# Altium schematic sheet [02] - BLOCK DIAGRAM.SchDoc
size A2; DocumentNumber: 2; SheetNumber: 2; SheetTotal: 31; PageSetup: Record=PageOptions|CenterHorizontal=True|CenterVertical=True|PrintScale=0.52|XCorrection=1.00|YCorrection=1.00|PrintKind=1|BorderSize=5000000|LeftOffset=0|BottomOffset=0|Orientation=2|PaperLength=1000|PaperWidth=1000|Scale=100|PaperSource=4|PrintQuality=600|MediaType=1|DitherType=10|PrintScaleMode=1|PaperKind=A4|PaperIndex=9
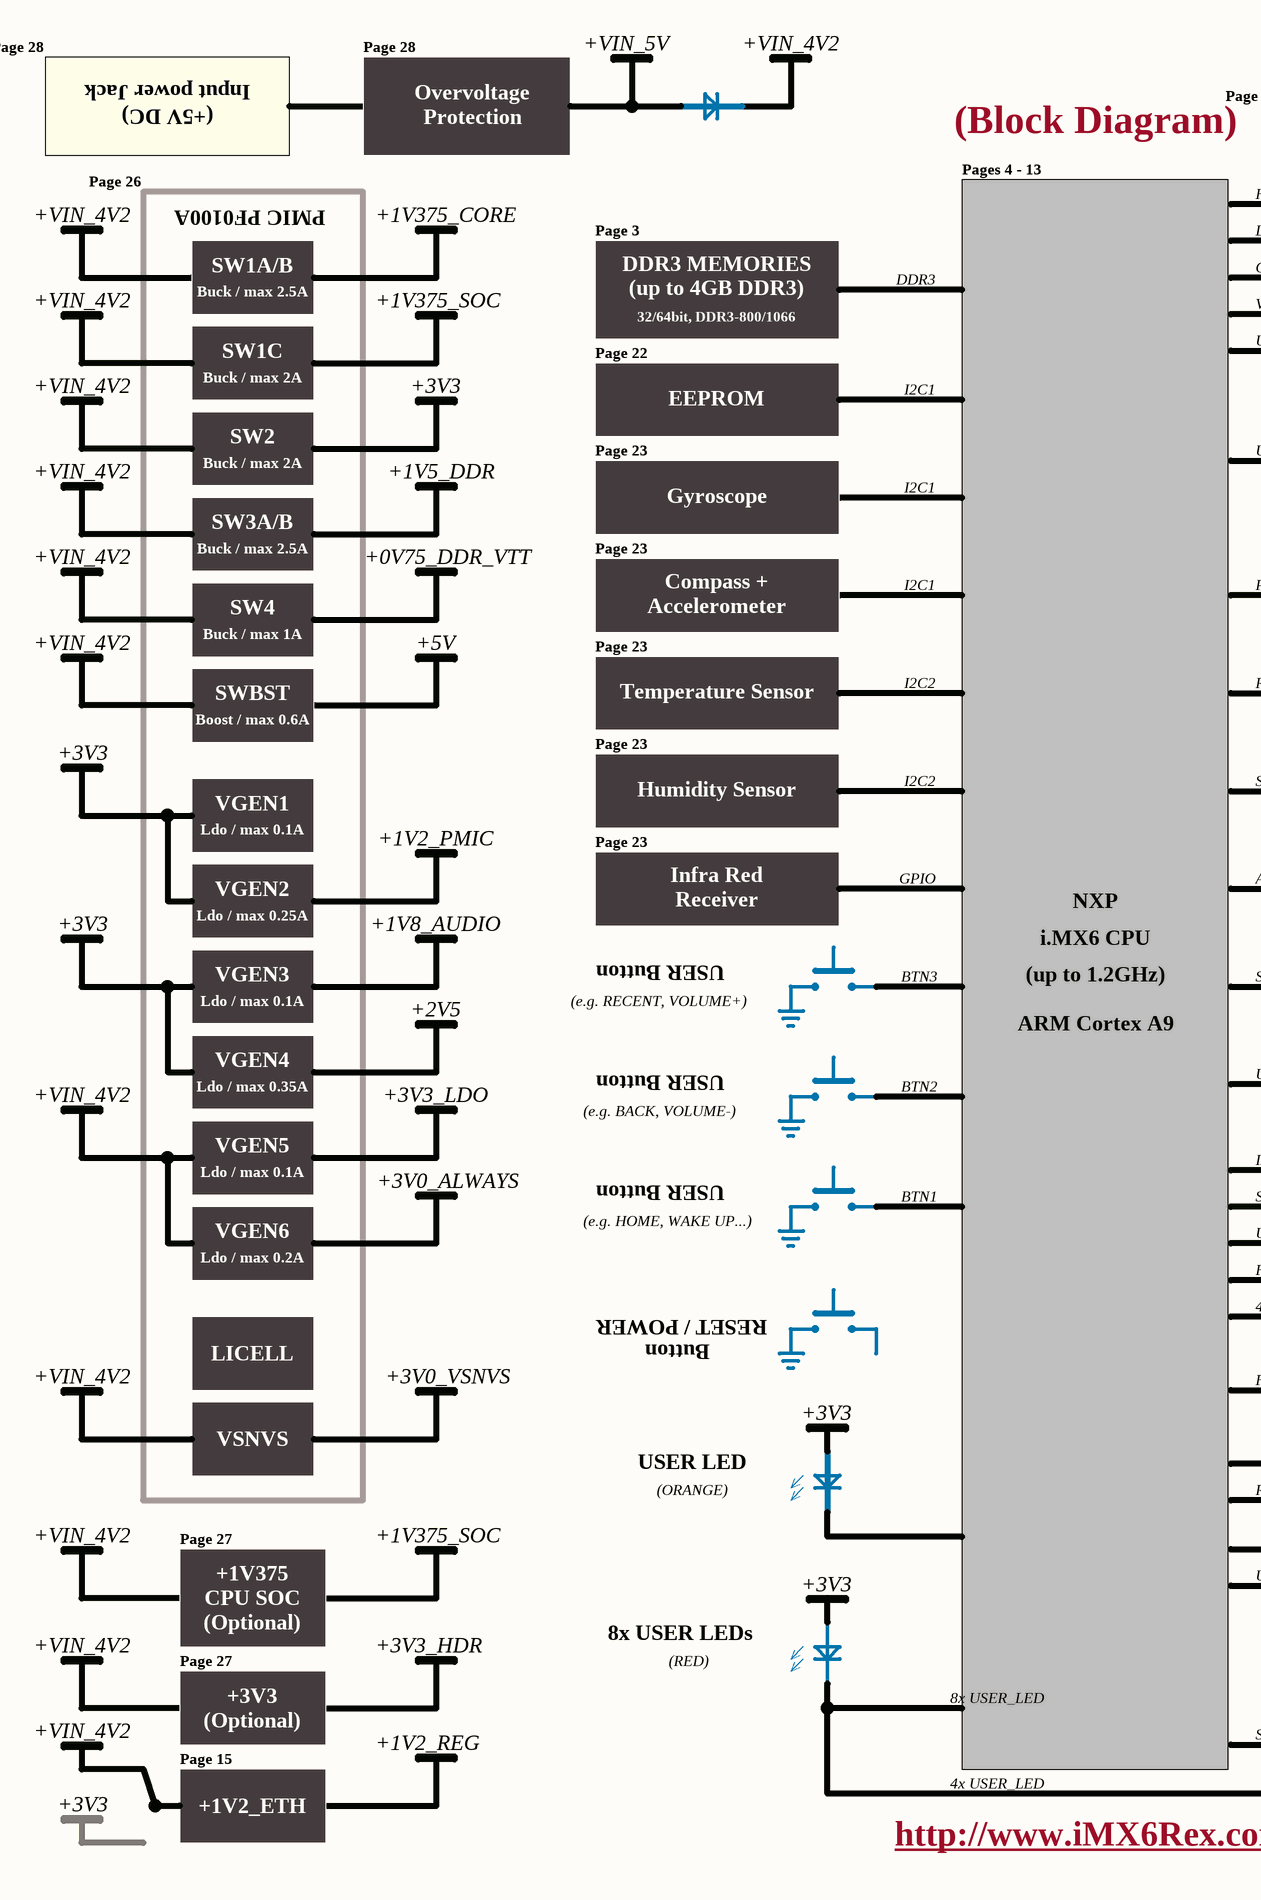
[diagram p0: [02] - BLOCK DIAGRAM.SchDoc, left]
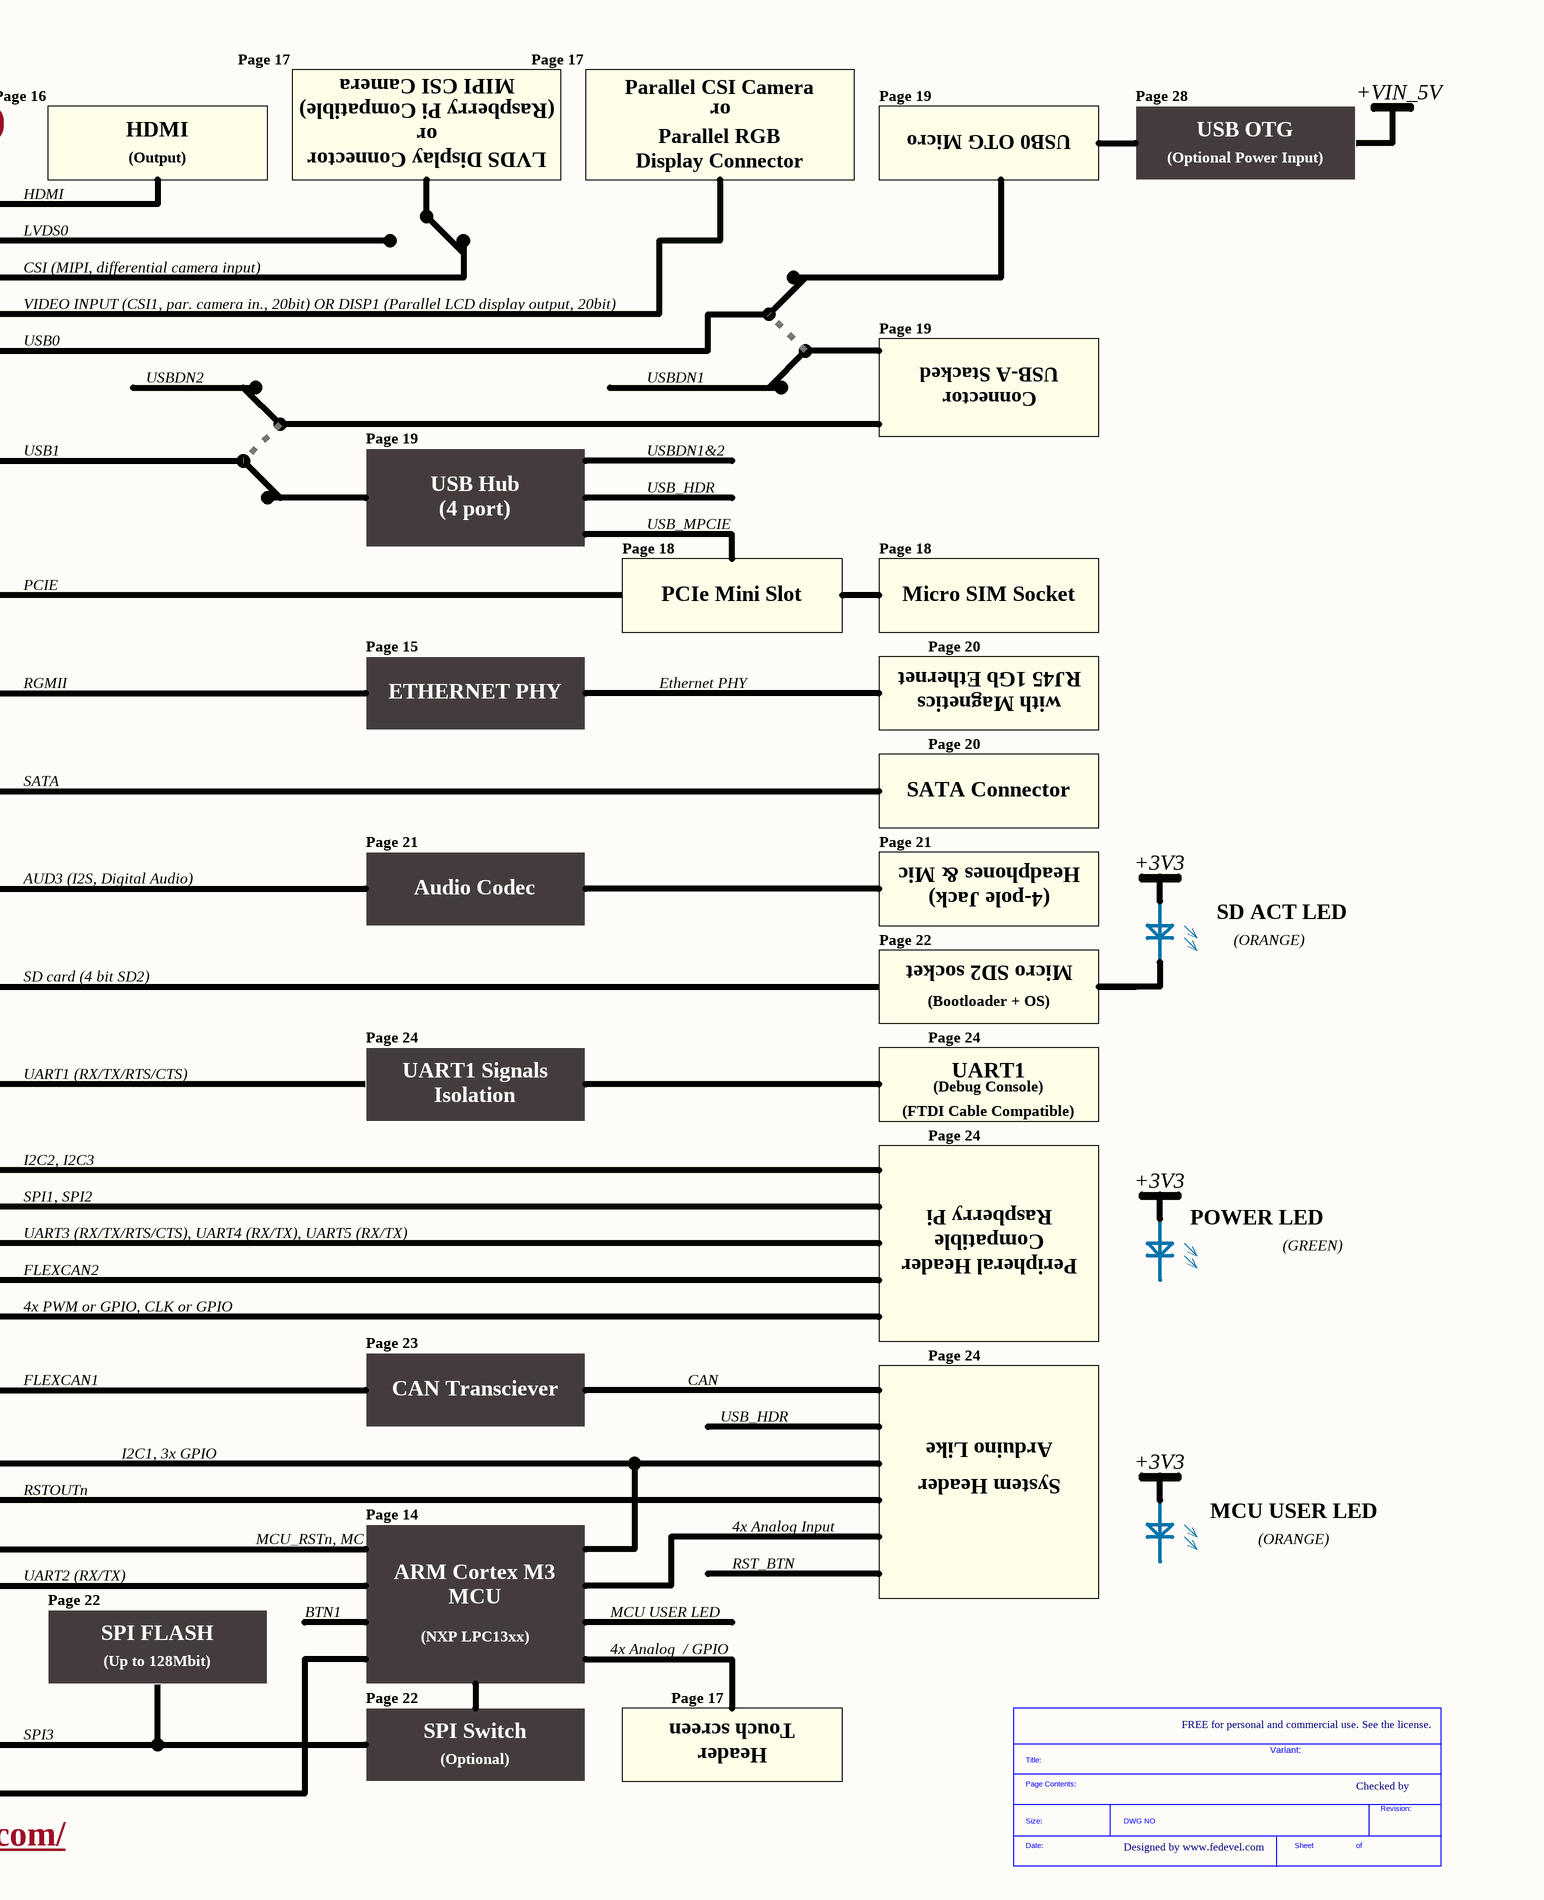
[diagram p1: [02] - BLOCK DIAGRAM.SchDoc, right]

## Parts
*  SDTitleBlock  (value not drawn)  (graphical)

## Notes on the sheet
- Page 28
- +VIN_5V
- +VIN_4V2
- Page 17
- MIPI CSI Camera
- Parallel CSI Camera
- Input power Jack
- (+5V DC)
- Overvoltage
- Protection
- (Block Diagram)
- Page 16
- HDMI
- (Raspberry Pi Compatible)
- or
- Parallel RGB
- Page 19
- USB0 OTG Micro
- USB OTG
- Page 26
- PMIC PF0100A
- Pages 4 - 13
- (Output)
- LVDS Display Connector
- Display Connector
- (Optional Power Input)
- SW1A/B
- +1V375_CORE
- Page 3
- DDR3 MEMORIES
- LVDS0
- CSI (MIPI, differential camera input)
- Buck / max 2.5A
- +1V375_SOC
- 32/64bit, DDR3-800/1066
- (up to 4GB DDR3)
- DDR3
- VIDEO INPUT (CSI1, par. camera in., 20bit) OR DISP1 (Parallel LCD display output, 20bit)
- SW1C
- Buck / max 2A
- +3V3
- Page 22
- I2C1
- USB0
- USBDN2
- USBDN1
- USB-A Stacked
- SW2
- Page 23
- EEPROM
- USB1
- USBDN1&2
- Connector
- SW3A/B
- +1V5_DDR
- Gyroscope
- USB Hub
- (4 port)
- USB_HDR
- +0V75_DDR_VTT
- Page 18
- USB_MPCIE
- SW4
- Buck / max 1A
- Compass +
- Accelerometer
- PCIE
- PCIe Mini Slot
- Micro SIM Socket
- SWBST
- +5V
- Temperature Sensor
- I2C2
- RGMII
- Page 15
- ETHERNET PHY
- Ethernet PHY
- Page 20
- RJ45 1Gb Ethernet
- Boost / max 0.6A
- with Magnetics
- VGEN1
- Humidity Sensor
- SATA
- SATA Connector
- Ldo / max 0.1A
- VGEN2
- +1V2_PMIC
- Infra Red
- GPIO
- AUD3 (I2S, Digital Audio)
- Page 21
- Headphones & Mic
- Ldo / max 0.25A
- +1V8_AUDIO
- Receiver
- NXP
- i.MX6 CPU
- Audio Codec
- (4-pole Jack)
- (ORANGE)
- SD ACT LED
- VGEN3
- (e.g. RECENT, VOLUME+)
- USER Button
- BTN3
- (up to 1.2GHz)
- SD card (4 bit SD2)
- Micro SD2 socket
- (Bootloader + OS)
- VGEN4
- +2V5
- ARM Cortex A9
- Page 24
- Ldo / max 0.35A
- +3V3_LDO
- (e.g. BACK, VOLUME-)
- BTN2
- UART1 (RX/TX/RTS/CTS)
- UART1 Signals
- Isolation
- UART1
- (Debug Console)
- (FTDI Cable Compatible)
- VGEN5
- +3V0_ALWAYS
- I2C2, I2C3
- VGEN6
- (e.g. HOME, WAKE UP...)
- BTN1
- SPI1, SPI2
- UART3 (RX/TX/RTS/CTS), UART4 (RX/TX), UART5 (RX/TX)
- Raspberry Pi
- Compatible
- POWER LED
- (GREEN)
- Ldo / max 0.2A
- 4x PWM or GPIO, CLK or GPIO
- FLEXCAN2
- Peripheral Header
- LICELL
- RESET / POWER
- Button
- VSNVS
- +3V0_VSNVS
- FLEXCAN1
- CAN Transciever
- CAN
- USER LED
- RSTOUTn
- I2C1, 3x GPIO
- System Header
- Arduino Like
- Page 27
- MCU_RSTn, MCU_ISPn, SWD debug
- Page 14
- 4x Analog Input
- MCU USER LED
- +1V375
- CPU SOC
- (Optional)
- UART2 (RX/TX)
- ARM Cortex M3
- MCU
- RST_BTN
- +3V3_HDR
- (RED)
- 8x USER LEDs
- SPI FLASH
- (Up to 128Mbit)
- (NXP LPC13xx)
- 4x Analog  / GPIO
- 8x USER_LED
- SPI3
- SPI Switch
- Touch screen
- FREE for personal and commercial use. See the license.
- +1V2_ETH
- +1V2_REG
- 4x USER_LED
- Header
- Variant:
- Checked by
- http://www.iMX6Rex.com/
- Designed by www.fedevel.com
- (in symbol SDTitleBlock) Title:; Page Contents:; Revision:; Size:; DWG NO; Date:; Sheet; of